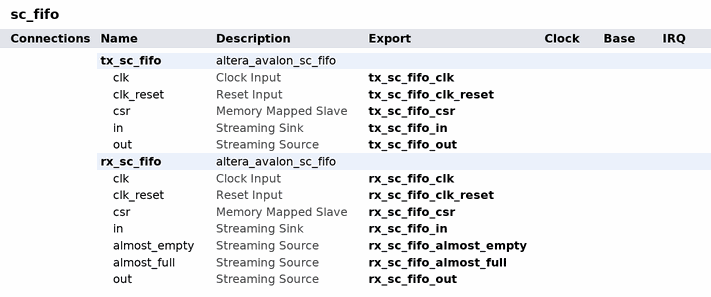
[diagram p0: system contents]
# Platform Designer (Qsys) system sc_fifo, Arria 10 10AX115U1F45I1SG
# Parameters at their usual value, and those the tool derives, are not listed.
package require -exact qsys 16.0
create_system sc_fifo
set_project_property DEVICE_FAMILY {Arria 10}
set_project_property DEVICE 10AX115U1F45I1SG

add_instance tx_sc_fifo altera_avalon_sc_fifo 16.0
set_instance_parameter_value tx_sc_fifo BITS_PER_SYMBOL 8
set_instance_parameter_value tx_sc_fifo CHANNEL_WIDTH 0
set_instance_parameter_value tx_sc_fifo ERROR_WIDTH 1
set_instance_parameter_value tx_sc_fifo FIFO_DEPTH 1024
set_instance_parameter_value tx_sc_fifo SYMBOLS_PER_BEAT 8
set_instance_parameter_value tx_sc_fifo USE_FILL_LEVEL 1
set_instance_parameter_value tx_sc_fifo USE_MEMORY_BLOCKS 1
set_instance_parameter_value tx_sc_fifo USE_PACKETS 1
set_instance_parameter_value tx_sc_fifo USE_STORE_FORWARD 1

add_instance rx_sc_fifo altera_avalon_sc_fifo 16.0
set_instance_parameter_value rx_sc_fifo BITS_PER_SYMBOL 8
set_instance_parameter_value rx_sc_fifo CHANNEL_WIDTH 0
set_instance_parameter_value rx_sc_fifo ERROR_WIDTH 6
set_instance_parameter_value rx_sc_fifo FIFO_DEPTH 1024
set_instance_parameter_value rx_sc_fifo SYMBOLS_PER_BEAT 8
set_instance_parameter_value rx_sc_fifo USE_ALMOST_EMPTY_IF 1
set_instance_parameter_value rx_sc_fifo USE_ALMOST_FULL_IF 1
set_instance_parameter_value rx_sc_fifo USE_FILL_LEVEL 1
set_instance_parameter_value rx_sc_fifo USE_MEMORY_BLOCKS 1
set_instance_parameter_value rx_sc_fifo USE_PACKETS 1
set_instance_parameter_value rx_sc_fifo USE_STORE_FORWARD 1

# exported interfaces
add_interface rx_sc_fifo_almost_empty avalon_streaming source
set_interface_property rx_sc_fifo_almost_empty EXPORT_OF rx_sc_fifo.almost_empty
add_interface rx_sc_fifo_almost_full avalon_streaming source
set_interface_property rx_sc_fifo_almost_full EXPORT_OF rx_sc_fifo.almost_full
add_interface rx_sc_fifo_clk clock sink
set_interface_property rx_sc_fifo_clk EXPORT_OF rx_sc_fifo.clk
add_interface rx_sc_fifo_clk_reset reset sink
set_interface_property rx_sc_fifo_clk_reset EXPORT_OF rx_sc_fifo.clk_reset
add_interface rx_sc_fifo_csr avalon slave
set_interface_property rx_sc_fifo_csr EXPORT_OF rx_sc_fifo.csr
add_interface rx_sc_fifo_in avalon_streaming sink
set_interface_property rx_sc_fifo_in EXPORT_OF rx_sc_fifo.in
add_interface rx_sc_fifo_out avalon_streaming source
set_interface_property rx_sc_fifo_out EXPORT_OF rx_sc_fifo.out
add_interface tx_sc_fifo_clk clock sink
set_interface_property tx_sc_fifo_clk EXPORT_OF tx_sc_fifo.clk
add_interface tx_sc_fifo_clk_reset reset sink
set_interface_property tx_sc_fifo_clk_reset EXPORT_OF tx_sc_fifo.clk_reset
add_interface tx_sc_fifo_csr avalon slave
set_interface_property tx_sc_fifo_csr EXPORT_OF tx_sc_fifo.csr
add_interface tx_sc_fifo_in avalon_streaming sink
set_interface_property tx_sc_fifo_in EXPORT_OF tx_sc_fifo.in
add_interface tx_sc_fifo_out avalon_streaming source
set_interface_property tx_sc_fifo_out EXPORT_OF tx_sc_fifo.out

set_interconnect_requirement {$system} qsys_mm.clockCrossingAdapter HANDSHAKE
set_interconnect_requirement {$system} qsys_mm.insertDefaultSlave FALSE
set_interconnect_requirement {$system} qsys_mm.maxAdditionalLatency 1

save_system sc_fifo.qsys
